# EAGLE design bmw (EAGLE 6.6.0)
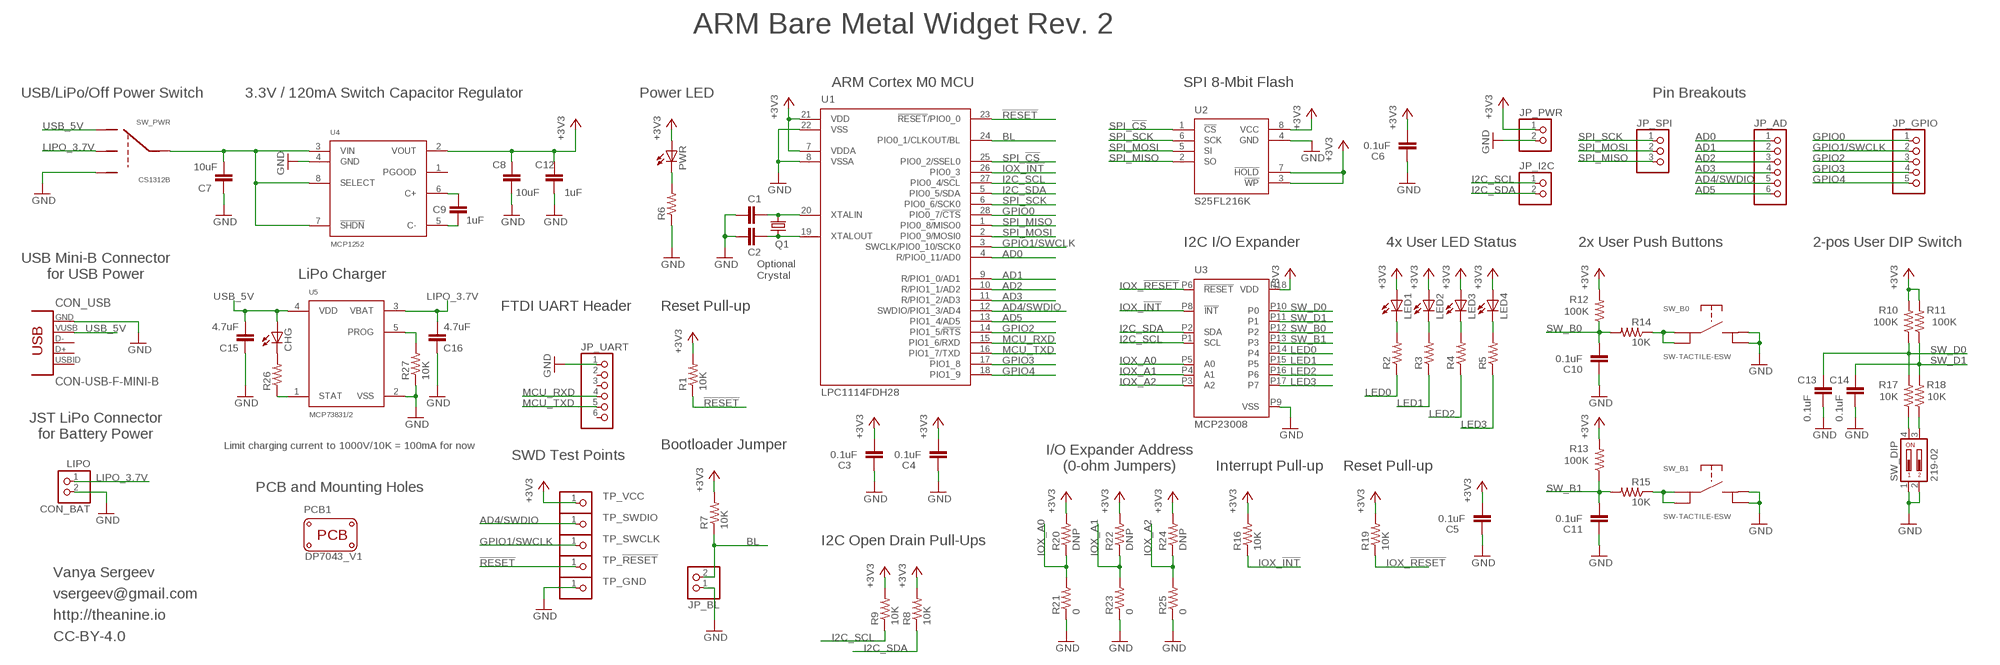
[diagram p0: schematic, sheet 1]

## Parts
C1  C-EUC0805  [C0805]
C2  C-EUC0805  [C0805]
C3  0.1uF  C-EUC0805  [C0805]
C4  0.1uF  C-EUC0805  [C0805]
C5  0.1uF  C-EUC0805  [C0805]
C6  0.1uF  C-EUC0805  [C0805]
C7  10uF  C-EUC1206  [C1206]
C8  10uF  C-EUC1206  [C1206]
C9  1uF  C-EUC0805  [C0805]
C10  0.1uF  C-EUC0805  [C0805]
C11  0.1uF  C-EUC0805  [C0805]
C12  1uF  C-EUC0805  [C0805]
C13  0.1uF  C-EUC0805  [C0805]
C14  0.1uF  C-EUC0805  [C0805]
C15  4.7uF  C-EUC0805  [C0805]
C16  4.7uF  C-EUC0805  [C0805]
CHG  LEDCHIPLED_0805  [CHIPLED_0805]
CON_BAT  LIPO  JST_2PIN-SMT-RA  [JST-PH-2-SMT-RA]
CON_USB  CON-USB-F-MINI-B  [CONN_USB_MINI-B]
JP_AD  PINHD-1X6  [1X06]
JP_BL  PINHD-1X2  [1X02]
JP_GPIO  PINHD-1X5  [1X05]
JP_I2C  PINHD-1X2  [1X02]
JP_PWR  PINHD-1X2  [1X02]
JP_SPI  PINHD-1X3  [1X03]
JP_UART  PINHD-1X6/90  [1X06/90]
LED1  LEDCHIPLED_0805  [CHIPLED_0805]
LED2  LEDCHIPLED_0805  [CHIPLED_0805]
LED3  LEDCHIPLED_0805  [CHIPLED_0805]
LED4  LEDCHIPLED_0805  [CHIPLED_0805]
PCB1  PCB_DP_RECTANGLE-43X70  [DP7043_V1]
PWR  LEDCHIPLED_0805  [CHIPLED_0805]
Q1  CRYSTALHC49UP  [HC49UP]
R1  10K  R-US_R0805  [R0805]
R2  R-US_R0805  [R0805]
R3  R-US_R0805  [R0805]
R4  R-US_R0805  [R0805]
R5  R-US_R0805  [R0805]
R6  R-US_R0805  [R0805]
R7  10K  R-US_R0805  [R0805]
R8  10K  R-US_R0805  [R0805]
R9  10K  R-US_R0805  [R0805]
R10  100K  R-US_R0805  [R0805]
R11  100K  R-US_R0805  [R0805]
R12  100K  R-US_R0805  [R0805]
R13  100K  R-US_R0805  [R0805]
R14  10K  R-US_R0805  [R0805]
R15  10K  R-US_R0805  [R0805]
R16  10K  R-US_R0805  [R0805]
R17  10K  R-US_R0805  [R0805]
R18  10K  R-US_R0805  [R0805]
R19  10K  R-US_R0805  [R0805]
R20  DNP  R-US_R0603  [R0603]
R21  0  R-US_R0603  [R0603]
R22  DNP  R-US_R0603  [R0603]
R23  0  R-US_R0603  [R0603]
R24  DNP  R-US_R0603  [R0603]
R25  0  R-US_R0603  [R0603]
R26  R-US_R0805  [R0805]
R27  10K  R-US_R0805  [R0805]
SW_B0  SW-TACTILE-ESW  [SW-TACT-ESW]
SW_B1  SW-TACTILE-ESW  [SW-TACT-ESW]
SW_DIP  219-02  [CTS-219-02]
SW_PWR  CS1312B  [CS1312B]
TP_!RESET  PINHD-1X1  [1X01]
TP_GND  PINHD-1X1  [1X01]
TP_SWCLK  PINHD-1X1  [1X01]
TP_SWDIO  PINHD-1X1  [1X01]
TP_VCC  PINHD-1X1  [1X01]
U1  LPC1114FDH28  [TSSOP28]
U2  S25FL216K  S25FL208K  [SOIC127P600X175-8N]
U3  MCP23008  [SOIC-18W]
U4  MCP1252  [MSOP8]
U5  MCP73831/2  [SOT23-5L]

## Nets
!RESET!: R1.1 TP_!RESET.1 U1.23(!RESET!/PIO0_0)
+3V3: C3.2 C4.2 C5.2 C6.2 C8.2 C12.2 JP_PWR.1 LED1.A LED2.A LED3.A LED4.A PWR.A R1.2 R7.2 R8.2 R9.2 R10.2 R11.2 R12.2 R13.2 R16.2 R19.2 R20.2 R22.2 R24.2 TP_VCC.1 U1.7(VDDA) U1.21(VDD) U2.3(!WP!) U2.7(!HOLD!) U2.8(VCC) U3.P18(VDD) U4.2(VOUT)
AD0: JP_AD.1 U1.4(R/PIO0_11/AD0)
AD1: JP_AD.2 U1.9(R/PIO1_0/AD1)
AD2: JP_AD.3 U1.10(R/PIO1_1/AD2)
AD3: JP_AD.4 U1.11(R/PIO1_2/AD3)
AD4/SWDIO: JP_AD.5 TP_SWDIO.1 U1.12(SWDIO/PIO1_3/AD4)
AD5: JP_AD.6 U1.13(PIO1_4/AD5)
BL: JP_BL.2 R7.1 U1.24(PIO0_1/CLKOUT/BL)
GND: C1.1 C2.1 C3.1 C4.1 C5.1 C6.1 C7.1 C8.1 C10.1 C11.1 C12.1 C13.2 C14.2 C15.1 C16.1 CON_BAT.2 CON_USB.GND JP_BL.1 JP_PWR.2 JP_UART.1 R6.1 R21.1 R23.1 R25.1 R27.1 SW_B0.P3 SW_B0.P4 SW_B1.P3 SW_B1.P4 SW_DIP.1 SW_DIP.2 SW_PWR.P4 TP_GND.1 U1.8(VSSA) U1.22(VSS) U2.4(GND) U3.P9(VSS) U4.4(GND) U5.2(VSS)
GPIO0: JP_GPIO.1 U1.28(PIO0_7/!CTS!)
GPIO1/SWCLK: JP_GPIO.2 TP_SWCLK.1 U1.3(SWCLK/PIO0_10/SCK0)
GPIO2: JP_GPIO.3 U1.14(PIO1_5/!RTS!)
GPIO3: JP_GPIO.4 U1.17(PIO1_8)
GPIO4: JP_GPIO.5 U1.18(PIO1_9)
I2C_SCL: JP_I2C.1 R9.1 U1.27(PIO0_4/SCL) U3.P1(SCL)
I2C_SDA: JP_I2C.2 R8.1 U1.5(PIO0_5/SDA) U3.P2(SDA)
IOX_!INT: R16.1 U1.26(PIO0_3) U3.P8(!INT)
IOX_!RESET: R19.1 U3.P6(!RESET)
IOX_A0: R20.1 R21.2 U3.P5(A0)
IOX_A1: R22.1 R23.2 U3.P4(A1)
IOX_A2: R24.1 R25.2 U3.P3(A2)
LED0: R2.1 U3.P14(P4)
LED1: R3.1 U3.P15(P5)
LED2: R4.1 U3.P16(P6)
LED3: R5.1 U3.P17(P7)
LIPO_3.7V: C16.2 CON_BAT.1 SW_PWR.P2 U5.3(VBAT)
MCU_RXD: JP_UART.4 U1.15(PIO1_6/RXD)
MCU_TXD: JP_UART.5 U1.16(PIO1_7/TXD)
N$1: R17.1 SW_DIP.4
N$2: C1.2 Q1.2 U1.20(XTALIN)
N$3: C2.2 Q1.1 U1.19(XTALOUT)
N$4: PWR.C R6.2
N$5: C7.2 SW_PWR.P3(C) U4.3(VIN) U4.7(!SHDN) U4.8(SELECT)
N$6: C9.2 U4.6(C+)
N$7: C9.1 U4.5(C-)
N$8: LED1.C R2.2
N$9: LED2.C R3.2
N$10: LED3.C R4.2
N$11: LED4.C R5.2
N$12: R14.1 SW_B0.P1 SW_B0.P2
N$13: R15.1 SW_B1.P1 SW_B1.P2
N$14: R18.1 SW_DIP.3
N$15: CHG.C R26.2
N$16: R26.1 U5.1(STAT)
N$17: R27.2 U5.5(PROG)
SPI_!CS!: U1.25(PIO0_2/SSEL0) U2.1(!CS!)
SPI_MISO: JP_SPI.3 U1.1(PIO0_8/MISO0) U2.2(SO)
SPI_MOSI: JP_SPI.2 U1.2(PIO0_9/MOSI0) U2.5(SI)
SPI_SCK: JP_SPI.1 U1.6(PIO0_6/SCK0) U2.6(SCK)
SW_B0: C10.2 R12.1 R14.2 U3.P12(P2)
SW_B1: C11.2 R13.1 R15.2 U3.P13(P3)
SW_D0: C13.1 R10.1 R17.2 U3.P10(P0)
SW_D1: C14.1 R11.1 R18.2 U3.P11(P1)
USB_5V: C15.2 CHG.A CON_USB.VUSB SW_PWR.P1 U5.4(VDD)
Unconnected: CON_USB.BODY@1(BODY) CON_USB.BODY@2(BODY) CON_USB.BODY@3(BODY) CON_USB.BODY@4(BODY) CON_USB.D+ CON_USB.D- CON_USB.ID(USBID) JP_UART.2 JP_UART.3 JP_UART.6 U4.1(PGOOD)

## Notes on the sheet
- ARM Bare Metal Widget Rev. 2
- ARM Cortex M0 MCU | SPI 8-Mbit Flash
- USB/LiPo/Off Power Switch | 3.3V / 120mA Switch Capacitor Regulator | Power LED | Pin Breakouts
- I2C I/O Expander | 4x User LED Status | 2x User Push Buttons | 2-pos User DIP Switch
- USB Mini-B Connector
  for USB Power
- LiPo Charger
- Optional
  Crystal
- FTDI UART Header | Reset Pull-up
- JST LiPo Connector
  for Battery Power
- Limit charging current to 1000V/10K = 100mA for now | Bootloader Jumper
- SWD Test Points
- I/O Expander Address
  (0-ohm Jumpers)
- Interrupt Pull-up | Reset Pull-up
- PCB and Mounting Holes
- I2C Open Drain Pull-Ups
- Vanya Sergeev
- vsergeev@gmail.com
- http://theanine.io
- CC-BY-4.0

## Library data of the parts
C1-C16 = rcl:C-EU: CAPACITOR, European symbol
CHG LED1-LED4 PWR = led:LED: LED OSRAM: - CHIPLED LG R971, LG N971, LY N971, LG Q971, LY Q971, LO R971, LY R971 LH N974, LH R974 LS Q976, LO Q976, LY Q976 LO Q996 - Hyper CHIPLED LW Q18S LB Q993, LB Q99A, LB R99A - SideLED LS A670, LO A670, LY A670, LG A670, LP A670 LB A673, LV A673, LT A673, LW A673 LH A674 LY A675 LS A676, LA A676, LO A676, LY A676, LW A676 LS A679, LY A679, LG A679 - Hyper Micro SIDELED® LS Y876, LA Y876, LO Y876, LY Y876 LT Y87S - SmartLED LW L88C, LW L88S LB L89C, LB L89S, LG L890 LS L89K, LO L89K, LY L89K LS L896, LA L896, LO L896, LY L896 - TOPLED LS T670, LO T670, LY T670, LG T670, LP T670 LSG T670, LSP T670, LSY T670, LOP T670, LYG T670 LG T671, LOG T671, LSG T671 LB T673, LV T673, LT T673, LW T673 LH T674 LS T676, LA T676, LO T676, LY T676, LB T676, LH T676, LSB T676, LW T676 LB T67C, LV T67C, LT T67C, LS T67K, LO T67K, LY T67K, LW E67C LS E67B, LA E67B, LO E67B, LY E67B, LB E67C, LV E67C, LT E67C LW T67C LS T679, LY T679, LG T679 LS T770, LO T770, LY T770, LG T770, LP T770 LB T773, LV T773, LT T773, LW T773 LH T774 LS E675, LA E675, LY E675, LS T675 LS T776, LA T776, LO T776, LY T776, LB T776 LHGB T686 LT T68C, LB T68C - Hyper Mini TOPLED® LB M676 - Mini TOPLED Santana® LG M470 LS M47K, LO M47K, LY M47K Source: http://www.osram.convergy.de LUXEON: - LUMILED® LXK2-PW12-R00, LXK2-PW12-S00, LXK2-PW14-U00, LXK2-PW14-V00 LXK2-PM12-R00, LXK2-PM12-S00, LXK2-PM14-U00 LXK2-PE12-Q00, LXK2-PE12-R00, LXK2-PE12-S00, LXK2-PE14-T00, LXK2-PE14-U00 LXK2-PB12-K00, LXK2-PB12-L00, LXK2-PB12-M00, LXK2-PB14-N00, LXK2-PB14-P00, LXK2-PB14-Q00 LXK2-PR12-L00, LXK2-PR12-M00, LXK2-PR14-Q00, LXK2-PR14-R00 LXK2-PD12-Q00, LXK2-PD12-R00, LXK2-PD12-S00 LXK2-PH12-R00, LXK2-PH12-S00 LXK2-PL12-P00, LXK2-PL12-Q00, LXK2-PL12-R00 Source: www.luxeon.com KINGBRIGHT: KA-3528ASYC Source: www.kingbright.com
CON_BAT = adafruit:JST_2PIN: JST 2-Pin Connectors of various flavors SMT-RA (S2B-PH-SM4) 4UConnector #17311 SMT (B2B-PH-SM4) THM-RA (S2B-PH) THM (B2B-PH)
CON_USB = dp_devices:CON-USB-F: USB Female connector
JP_AD JP_UART = pinhead:PINHD-1X6: PIN HEADER
JP_BL JP_I2C JP_PWR = pinhead:PINHD-1X2: PIN HEADER
JP_GPIO = pinhead:PINHD-1X5: PIN HEADER
JP_SPI = pinhead:PINHD-1X3: PIN HEADER
PCB1 = dp_devices:PCB_DP_RECTANGLE: Dangerous Prototypes Standard Rectangular PCB sizes; PCB_SIZE: DP7043_V1
Q1 = crystal:CRYSTAL: CRYSTAL; OC_FARNELL: unknown; OC_NEWARK: unknown
R1-R27 = rcl:R-US_: RESISTOR, American symbol
SW_B0 SW_B1 = ivan:SW-TACTILE-ESW
SW_DIP = switch-dil:219-02*: Surface Mount DIP Switch Series 219 SMT CTS Electronic Components Sourc: www.ctscorp.com; OC_FARNELL: unknown; OC_NEWARK: unknown
SW_PWR = ivan:CS1312B
TP_!RESET TP_GND TP_SWCLK TP_SWDIO TP_VCC = pinhead:PINHD-1X1: PIN HEADER
U1 = ivan:LPC1114FDH28
U2 = ivan:S25FL208K
U3 = ivan:MCP23008
U4 = ivan:MCP1252
U5 = ivan:MCP73831/2

## Board
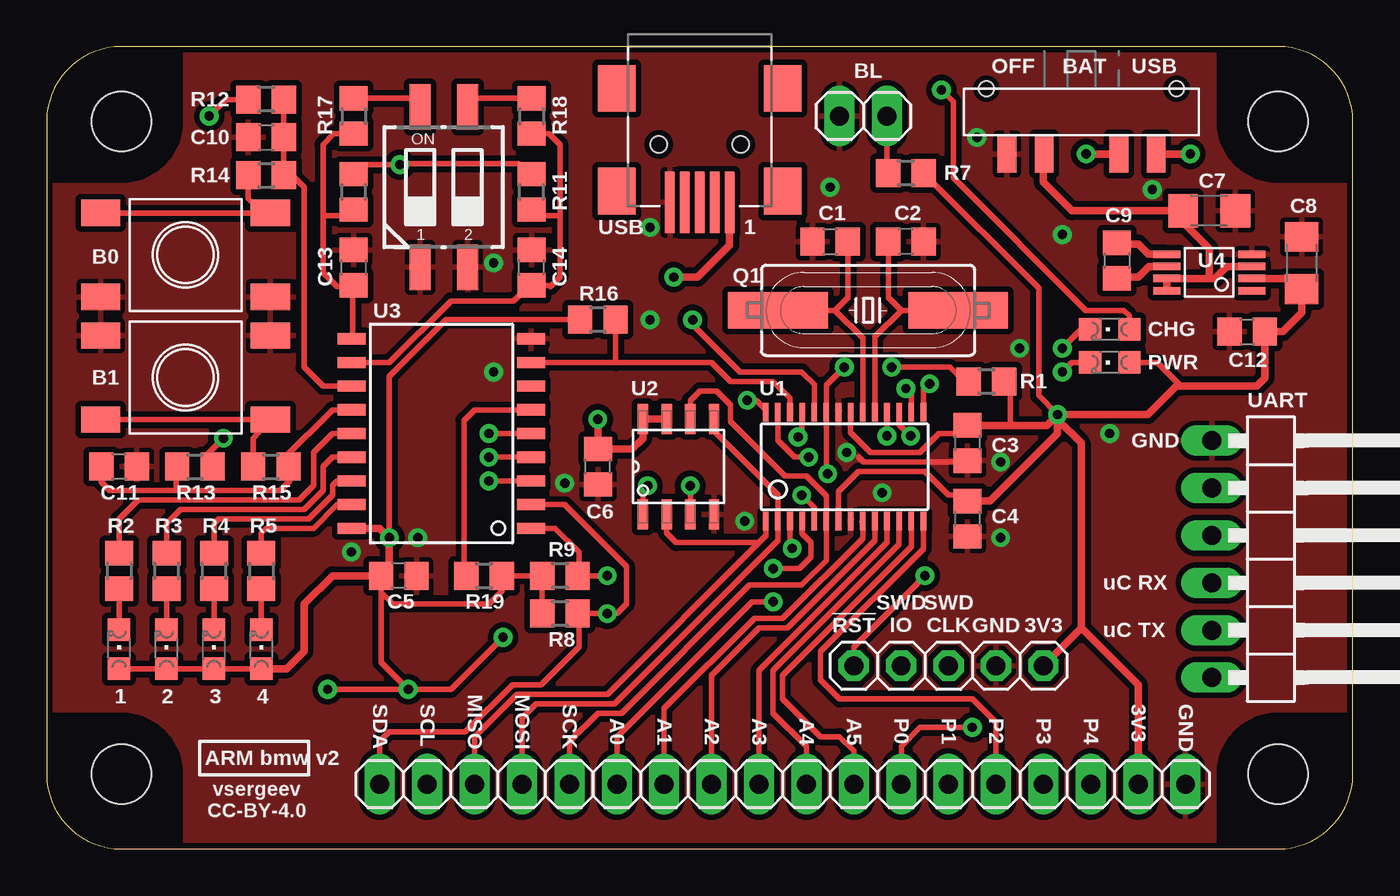
[diagram p1: board, top side]
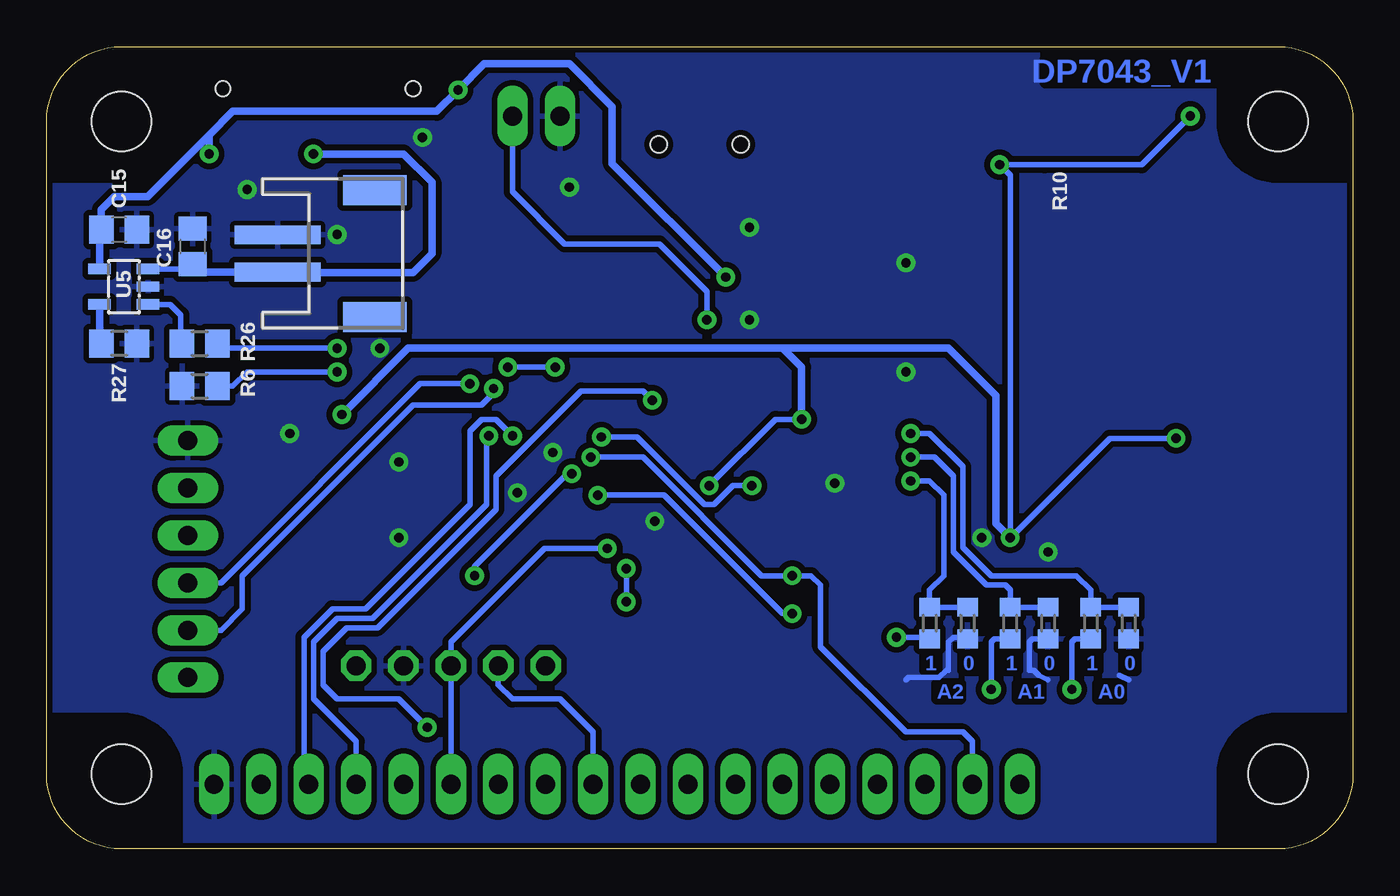
[diagram p2: board, bottom side, seen from below]

Size 70 x 43 mm. Coordinates in mm from the lower left corner, seen from the top.
Copper layers (1*16): Top 0.035mm / dielectric 1.5mm / Bottom 0.035mm
Design rules "SparkFun-mod": minimum track width 8mil, minimum drill 15mil, track to track 6mil, track to pad 6mil, pad to pad 6mil, via to via 6mil, smd to smd 6mil, copper to edge 10mil, drill to drill 8mil, minimum pad ring 12mil, minimum via ring 10mil, stop-mask expansion 4mil, vias tented up to drill 25mil, thermal gap 10mil

### Footprints (pad centres in the part's own frame; a part is rotated, then mirrored left to right if it is on the bottom)
C0805 = smd 1.3 x 1.5: 1 -0.95,0; 2 0.95,0
C1206 = smd 1.6 x 1.8: 1 -1.4,0; 2 1.4,0
CHIPLED_0805 = smd 1.2 x 1.2: A 0,-1.05; C 0,1.05
JST-PH-2-SMT-RA = smd 1 x 4.6: 1 1,-3.7; 2 -1,-3.7 | smd 1.6 x 3.4: NC1 -3.4,1.5; NC2 3.4,1.5
CONN_USB_MINI-B = smd 2 x 2.5: BODY@1 -4.45,2.5; BODY@2 4.45,2.5; BODY@3 4.45,-3; BODY@4 -4.45,-3 | smd 0.5 x 3.3: D+ 0,3.1; D- -0.8,3.1; GND 1.6,3.1; ID 0.8,3.1; VUSB -1.6,3.1 | hole 0.9: -2.2,0; 2.2,0
1X06 = drill 1.016 long: 1 -6.35,0; 2 -3.81,0; 3 -1.27,0; 4 1.27,0; 5 3.81,0; 6 6.35,0
1X02 = drill 1.016 long: 1 -1.27,0; 2 1.27,0
1X05 = drill 1.016 long: 1 -5.08,0; 2 -2.54,0; 3 0,0; 4 2.54,0; 5 5.08,0
1X03 = drill 1.016 long: 1 -2.54,0; 2 0,0; 3 2.54,0
1X06/90 = drill 1.016 long: 1 -6.35,-3.81; 2 -3.81,-3.81; 3 -1.27,-3.81; 4 1.27,-3.81; 5 3.81,-3.81; 6 6.35,-3.81
DP7043_V1 = hole 3.2: -31,-17.5; 31,-17.5; 31,17.5; -31,17.5
HC49UP = smd 5.334 x 1.93: 1 -4.826,0; 2 4.826,0
R0805 = smd 1.3 x 1.5: 1 -0.95,0; 2 0.95,0
R0603 = smd 1 x 1.1: 1 -0.85,0; 2 0.85,0
SW-TACT-ESW = smd 2.1 x 1.4: P1 -4.55,2.3; P2 4.55,2.3; P3 -4.55,-2.2; P4 4.55,-2.2
CTS-219-02 = smd 1.13 x 2.44: 1 -1.27,-4.3; 2 1.27,-4.3; 3 1.27,4.3; 4 -1.27,4.3
CS1312B = smd 1 x 2: P1 -0.2,0; P2 1.8,0; P3 5.8,0; P4 7.8,0 | hole 0.8: 8.9,-3.5; -1.3,-3.5
1X01 = drill 1.016 octagon: 1 0,0
TSSOP28 = smd 0.305 x 0.991: 1 -4.225,-2.918; 2 -3.575,-2.918; 3 -2.925,-2.918; 4 -2.275,-2.918; 5 -1.625,-2.918; 6 -0.975,-2.918; 7 -0.325,-2.918; 8 0.325,-2.918; 9 0.975,-2.918; 10 1.625,-2.918; 11 2.275,-2.918; 12 2.925,-2.918; 13 3.575,-2.918; 14 4.225,-2.918; 15 4.225,2.918; 16 3.575,2.918; 17 2.925,2.918; 18 2.275,2.918; 19 1.625,2.918; 20 0.975,2.918; 21 0.325,2.918; 22 -0.325,2.918; 23 -0.975,2.918; 24 -1.625,2.918; 25 -2.275,2.918; 26 -2.925,2.918; 27 -3.575,2.918; 28 -4.225,2.918
SOIC127P600X175-8N = smd 1.6 x 0.559: 1 -2.565,1.905; 2 -2.565,0.635; 3 -2.565,-0.635; 4 -2.565,-1.905; 5 2.565,-1.905; 6 2.565,-0.635; 7 2.565,0.635; 8 2.565,1.905
SOIC-18W = smd 0.6 x 1.5: P1 -5.08,-4.81; P2 -3.81,-4.81; P3 -2.54,-4.81; P4 -1.27,-4.81; P5 0,-4.81; P6 1.27,-4.81; P7 2.54,-4.81; P8 3.81,-4.81; P9 5.08,-4.81; P10 5.08,4.81; P11 3.81,4.81; P12 2.54,4.81; P13 1.27,4.81; P14 0,4.81; P15 -1.27,4.81; P16 -2.54,4.81; P17 -3.81,4.81; P18 -5.08,4.81
MSOP8 = smd 0.4 x 1.45: 1 -0.975,-2.275; 2 -0.325,-2.275; 3 0.325,-2.275; 4 0.975,-2.275; 5 0.975,2.275; 6 0.325,2.275; 7 -0.325,2.275; 8 -0.975,2.275
SOT23-5L = smd 0.55 x 1.2: 1 -0.95,-1.3; 2 0,-1.3; 3 0.95,-1.3; 4 0.95,1.3; 5 -0.95,1.3

### Placement (x,y rotation side)
C1  41.98,32.55 0 top
C2  46.05,32.55 180 top
C3  49.35,21.75 90 top
C4  49.35,17.69 90 top
C5  18.87,14.64 180 top
C6  29.54,20.48 90 top
C7  62.3,34.2 180 top
C8  67.26,31.41 270 top
C9  57.35,31.53 270 top
C10  11.76,38.14 0 top
C11  3.88,20.48 180 top
C12  64.34,27.72 0 top
C13  16.46,31.15 90 top
C14  25.98,31.15 90 top
C15  66.11,33.18 180 bottom
C16  62.18,32.3 270 bottom
CHG  56.97,27.85 90 top
CON_BAT  53.92,31.91 270 bottom
CON_USB  35,37.76 180 top
JP_AD  36.91,3.47 0 top
JP_BL  43.76,39.28 0 top
JP_GPIO  50.88,3.47 0 top
JP_I2C  19.12,3.47 180 top
JP_PWR  59.77,3.47 0 top
JP_SPI  25.48,3.47 180 top
JP_UART  66.24,15.53 270 top
LED1  3.88,10.7 0 top
LED2  6.42,10.7 0 top
LED3  8.96,10.7 0 top
LED4  11.5,10.7 0 top
PCB1  35,21.5 0 top
PWR  56.97,26.07 90 top
Q1  44.02,28.87 180 top
R1  50.37,25.06 0 top
R2  3.88,14.9 270 top
R3  6.42,14.9 270 top
R4  8.96,14.9 270 top
R5  11.5,14.9 270 top
R6  61.8,24.8 0 bottom
R7  46.05,36.23 0 top
R8  27.51,12.61 180 top
R9  27.51,14.64 180 top
R10  16.46,35.22 90 top
R11  25.98,35.22 90 top
R12  11.76,40.17 180 top
R13  7.95,20.48 0 top
R14  11.76,36.1 0 top
R15  12.01,20.48 0 top
R16  29.54,28.36 180 top
R17  16.46,39.28 270 top
R18  25.98,39.28 270 top
R19  23.44,14.64 0 top
R20  14.05,12.1 270 bottom
R21  12.01,12.1 90 bottom
R22  18.36,12.1 270 bottom
R23  16.33,12.1 90 bottom
R24  22.68,12.1 270 bottom
R25  20.65,12.1 90 bottom
R26  61.8,27.09 0 bottom
R27  66.11,27.09 180 bottom
SW_B0  7.44,31.79 0 top
SW_B1  7.44,25.31 180 top
SW_DIP  21.28,35.47 0 top
SW_PWR  59.26,37.25 180 top
TP_!RESET  43.25,9.82 0 top
TP_GND  50.88,9.82 0 top
TP_SWCLK  48.33,9.82 0 top
TP_SWDIO  45.8,9.82 0 top
TP_VCC  53.41,9.82 0 top
U1  42.76,20.48 0 top
U2  33.86,20.48 90 top
U3  21.16,22.26 90 top
U4  62.3,30.9 90 top
U5  65.86,30.14 90 bottom

### Tracks (layer width: path | path; a pad name or v marks a point on that pad's centre or on a via)
!RESET!  (via drill 0.5)
  Top 0.305: v41.86,20.1 41.78,20.18 U1.23 41.78,24.86 v42.75,25.82 | v47.06,14.64 43.25,10.83 TP_!RESET.1 | v45.29,25.82 48.4,25.82 49.16,25.06 R1.1
  Bottom 0.305: v42.75,25.82 v45.29,25.82 | v41.86,20.1 42.11,20.1 47.06,15.15 v47.06,14.64
+3V3  (via drill 0.5)
  Top 0.305: LED1.A LED2.A LED3.A LED4.A | U1.7 42.43,19.15 43.51,20.23 47.06,20.23 48.33,18.96 48.78,18.96 C4.2 | R13.2 8.52,21.05 v9.47,22.01 | U2.3 v34.49,19.47 | 50.81,25.06 R1.2 51.64,25.06 51.64,22.7 | U1.21 43.08,22.3 44.14,21.25 46.81,21.25 47.83,22.26 48.91,22.26 C3.2 | 54.18,23.02 v54.18,23.28 53.16,24.29 53.16,30.07 R7.2 | 49.1,18.89 C4.2 | 49.03,18.45 C4.2 | R10.2 16.97,36.67 v18.92,36.67 18.99,36.74 25.28,36.74 R11.2 | R12.2 9.6,40.17 v8.71,39.28 | v18.36,16.67 18.36,25.31 21.41,28.36 R16.2 28.34,28.61 | v19.38,8.55 21.66,8.55 v24.46,11.34 | R8.2 R9.2 R19.2 24.39,13.81 23.7,13.12 18.56,13.12 17.92,13.75 | v19.38,8.55 17.92,10 17.92,13.75 | 17.92,13.75 C5.2 | v15.06,8.55 v19.38,8.55 | 60.78,24.8 59.51,26.07 PWR.A
  Top 0.406: U4.2 66.94,30.57 67.26,30.26 C8.2 67.26,28.74 66.24,27.72 C12.2 65.29,25.24 64.84,24.8 60.78,24.8 60.53,24.8 59,23.28 v54.18,23.28 | LED4.A 12.87,9.65 13.79,10.58 13.79,13.12 15.31,14.64 C5.2 | U2.7 U2.8 31.95,22.01 31.38,21.43 C6.2 v29.54,23.02 | 54.18,23.02 55.45,21.75 55.45,11.85 | 55.45,11.85 TP_VCC.1 | C3.2 51.64,22.7 53.6,22.7 v54.18,23.28 | C4.2 50.55,18.64 54.18,22.26 v54.18,23.28 | C5.2 18.36,14.77 | U3.P18 17.85,17.18 v18.36,16.67 18.36,14.64 C5.2 | 26.62,14.45 R9.2 | 55.45,11.85 58.5,8.8 JP_PWR.1
  Bottom 0.305: 16.52,36.67 v18.92,36.67 | v34.49,19.47 30.94,23.02 v29.54,23.02 | v8.71,39.28 11.32,36.67 v18.92,36.67 | v9.47,22.01 13.03,22.01 v18.36,16.67 18.36,36.11 v18.92,36.67 | R24.2 22.77,11.34 v24.46,11.34 | R20.2 14.89,11.25 15.06,11.09 v15.06,8.55 | R22.2 19.21,11.25 19.38,11.09 v19.38,8.55
  Bottom 0.406: v29.54,23.02 29.54,25.82 30.55,26.83 | v54.18,23.28 50.62,26.83 30.55,26.83 | 30.55,26.83 21.66,26.83 19.12,24.29 19.12,17.44 v18.36,16.67
AD0  (via drill 0.5)
  Top 0.305: JP_AD.1 30.55,6.01 37.79,13.24 v38.94,13.24 | U1.4 40.48,16.9 40.97,16.42 40.97,15.66 40.33,15.02 v38.94,15.02
  Bottom 0.305: v38.94,13.24 v38.94,15.02
AD1
  Top 0.305: 43.7,17.53 U1.9 43.73,16.65 39.44,12.36 37.92,12.36 33.09,7.53 JP_AD.2
AD2
  Top 0.305: 44.4,17.55 U1.10 44.39,16.53 39.7,11.85 38.17,11.85 35.64,9.31 JP_AD.3
AD3
  Top 0.305: 45.03,16.67 U1.11 45.03,16.42 38.17,9.56 JP_AD.4
AD4/SWDIO
  Top 0.305: 45.67,17.55 U1.12 45.69,16.67 45.69,16.56 45.69,16.31 38.94,9.56 38.94,7.28 40.72,5.5 JP_AD.5
  Bottom 0.305: JP_AD.5 40.72,6.26 42.49,8.04 45.03,8.04 45.8,8.8 TP_SWDIO.1
AD5
  Top 0.305: JP_AD.6 43.25,5.24 42.49,6.01 41.48,6.01 39.44,8.04 39.44,9.31 46.33,16.2 U1.13
BL  (via drill 0.5)
  Top 0.305: JP_BL.2 45.03,36.3 R7.1 | U1.24 41.14,24.89 40.46,25.56 37.16,25.56 34.62,28.1 v34.62,28.36
  Bottom 0.305: JP_BL.2 45.03,35.22 42.24,32.42 37.16,32.42 34.62,29.88 v34.62,28.36
GND  (via drill 0.5)
  Top 0.305: 49.1,20.74 43.76,20.74 43.51,20.99
  Bottom 0.305: 20.65,11.34 21.41,11.34 21.66,11.09 21.66,9.56 21.79,9.56 22.17,9.18 23.82,9.18 23.95,9.05 | 16.33,9.05 16.84,9.31 17.09,9.56 17.35,9.56 17.35,11.09 17.18,11.25 R23.1 | 12.52,9.31 12.01,9.05
  Bottom 0.406: R25.1 20.65,11.34
  other vias: 23.95,31.41 56.97,22.26 19.89,16.67 44.78,19.09 51.13,20.74 42.87,21.25 37.41,17.56 27.76,19.59 51.13,16.67 16.33,15.91 23.95,25.56 32.33,28.36 41.98,35.47 49.86,38.14 59.26,35.34 32.33,33.31 52.14,26.83 54.43,32.93
  pour Top (isolate 0.305): 0.07,42.84 69.92,43.09 69.92,0.16 0.07,0.16
  pour Bottom (isolate 0.305): 0.07,43.09 69.92,43.09 69.92,0.16 0.07,0.16
GPIO0  (via drill 0.5)
  Top 0.305: JP_GPIO.1 45.8,5.5 46.81,6.51 v49.61,6.51 | U1.28 38.53,23.55 38.05,24.04 v37.54,24.04
  Bottom 0.305: v37.54,24.04 38.05,24.55 41.35,24.55 45.92,19.98 45.92,18.2 52.27,11.85 53.92,11.85 55.19,10.58 55.19,8.8 54.43,8.04 51.13,8.04 v49.61,6.51
GPIO1/SWCLK  (via drill 0.5)
  Top 0.305: U1.3 39.83,16.22 v39.95,16.1
  Bottom 0.305: JP_GPIO.2 TP_SWCLK.1 48.33,11.09 43.32,16.1 v39.95,16.1
GPIO2
  Top 0.305: JP_GPIO.3 50.88,6.77 49.61,8.04 42.49,8.04 41.48,9.05 41.48,10.58 46.98,16.09 U1.14
GPIO3  (via drill 0.5)
  Top 0.305: U1.17 45.69,22.75 v46.3,22.13
  Bottom 0.305: v46.3,22.13 46.43,22.13 46.43,18.45 52.53,12.36 54.43,12.36 55.7,11.09 55.7,8.04 53.41,5.75 JP_GPIO.4
GPIO4  (via drill 0.5)
  Top 0.305: U1.18 v45.03,22.14 v45.03,22.13
  Bottom 0.305: v45.03,22.13 45.92,23.02 46.68,23.02 47.32,22.39 47.32,18.45 52.91,12.86 54.69,12.86 56.21,11.34 56.21,3.72 JP_GPIO.5
I2C_SCL  (via drill 0.5)
  Top 0.305: 28.52,14.58 R9.1 | U1.27 39.19,21.89 40.08,20.99 v40.84,20.99 | U3.P1 27.25,17.18 28.52,15.91 28.52,14.71 R9.1 | R9.1 28.71,14.39 28.96,14.64 v30.05,14.64
  Bottom 0.305: v40.84,20.99 38.05,20.99 31.7,14.64 v30.05,14.64 | 29.28,14.64 v30.05,14.64 | JP_I2C.1 20.39,5.75 20.9,6.26 23.95,6.26 28.52,10.83 28.52,14.13 29.03,14.64 v30.05,14.64
I2C_SDA  (via drill 0.5)
  Top 0.305: U1.5 41.14,18.29 v40.46,18.96 | U3.P2 27.76,18.45 31.06,15.15 31.06,13.12 30.55,12.61 v30.05,12.61 28.96,12.61 28.71,12.36 R8.1 28.52,12.29 28.52,10.83 26.49,8.8 24.97,8.8 22.43,6.26 18.36,6.26 17.85,5.75 JP_I2C.2
  Bottom 0.305: v40.46,18.96 36.91,18.96 30.55,12.61 v30.05,12.61
IOX_!INT
  Top 0.305: U1.26 39.83,24.16 38.94,25.06 36.65,25.06 35.64,26.07 30.55,26.07 30.49,26.07 | 30.49,26.07 U3.P8 | R16.1 30.49,26.07
IOX_!RESET
  Top 0.305: U3.P6 22.94,23.53 22.37,22.96 22.37,14.77 R19.1
IOX_A0  (via drill 0.5)
  Top 0.305: U3.P5 v23.7,22.26
  Bottom 0.305: R21.2 R20.1 14.05,13.88 14.81,14.64 19.38,14.64 20.9,16.17 20.9,20.48 22.68,22.26 v23.7,22.26
IOX_A1  (via drill 0.5)
  Top 0.305: U3.P4 v23.7,20.99
  Bottom 0.305: 18.07,12.82 R22.1 | R23.2 R22.1 | v23.7,20.99 22.43,20.99 21.41,19.98 21.41,15.91 19.63,14.13 18.62,14.13 18.36,13.88 R22.1
IOX_A2  (via drill 0.5)
  Top 0.305: U3.P3 v23.7,19.72
  Bottom 0.305: R25.2 R24.1 22.68,13.88 21.92,14.64 21.92,18.96 22.68,19.72 v23.7,19.72
LED0
  Top 0.305: R2.1 3.88,17.69 4.9,18.71 13.54,18.71 14.3,19.47 14.3,21.25 15.31,22.26 U3.P14
LED1
  Top 0.305: R3.1 6.42,17.44 7.19,18.2 13.79,18.2 14.81,19.21 14.81,20.48 15.31,20.99 U3.P15
LED2
  Top 0.305: U3.P16 15.57,19.72 15.31,19.47 15.31,18.96 14.05,17.69 9.22,17.69 8.96,17.44 R4.1
LED3
  Top 0.305: U3.P17 15.57,18.45 14.3,17.18 11.76,17.18 11.5,16.93 R5.1
LIPO_3.7V  (via drill 0.5)
  Top 0.406: SW_PWR.P2 v55.7,37.25
  Bottom 0.305: U5.3 62.69,31.09 62.56,30.96
  Bottom 0.406: C16.2 62.56,30.96 | 62.05,31.22 C16.2 | v55.7,37.25 50.88,37.25 49.35,35.72 49.35,31.91 50.37,30.9 57.61,30.9 CON_BAT.1 61.75,30.91 C16.2
MCU_RXD  (via drill 0.5)
  Top 0.305: U1.15 46.98,24.59 v47.32,24.93
  Bottom 0.305: JP_UART.4 60.65,14.26 49.99,24.93 v47.32,24.93
MCU_TXD  (via drill 0.5)
  Top 0.305: U1.16 46.33,24.39 v46.05,24.67
  Bottom 0.305: 61.03,11.72 JP_UART.5 60.65,11.72 59.51,12.86 59.51,14.64 50.37,23.79 46.68,23.79 46.05,24.42 v46.05,24.67
N$1
  Top 0.305: R17.1 19.43,40.23 SW_DIP.4
N$2
  Top 0.305: 39.89,28.23 39.83,28.23 Q1.2 | Q1.2 40.53,28.87 | U1.20 43.73,27.37 42.24,28.87 | 42.24,28.87 Q1.2 | C1.2 42.94,29.56 42.24,28.87
N$3
  Top 0.305: 48.65,29.06 Q1.1 45.8,28.87 | U1.19 44.39,27.46 45.8,28.87 | C2.2 45.1,29.56 45.8,28.87
N$4  (via drill 0.5)
  Top 0.305: v54.43,25.56 54.94,26.07 PWR.C
  Bottom 0.305: v54.43,25.56 59.26,25.56 60.02,24.8 R6.2
N$5
  Top 0.406: U4.8 U4.7 62.3,30.57 | 62.3,30.57 62.61,30.57 63.26,31.22 U4.3 | 62.3,30.57 62.3,32.17 60.91,33.57 C7.2 54.94,34.2 53.41,35.72 53.41,37.21 SW_PWR.P3
N$6
  Top 0.406: U4.6 59.07,31.22 58.5,30.64 57.41,30.64 C9.2
N$7
  Top 0.406: U4.5 59.04,31.87 58.5,32.42 57.41,32.42 C9.1
N$8
  Top 0.305: R2.2 LED1.C
N$9
  Top 0.305: R3.2 LED2.C
N$10
  Top 0.305: R4.2 LED3.C
N$11
  Top 0.305: R5.2 LED4.C
N$12
  Top 0.305: 11.25,34.21 11.5,34.17 | 11.5,34.17 SW_B0.P2 SW_B0.P1 | R14.1 10.81,34.86 11.5,34.17
N$13
  Top 0.305: 2.68,23.07 SW_B1.P2 SW_B1.P1 11.06,21.99 R15.1
N$14
  Top 0.305: R18.1 22.89,40.23 SW_DIP.3
N$15  (via drill 0.5)
  Top 0.305: CHG.C 55.45,27.85 v54.43,26.83
  Bottom 0.305: v54.43,26.83 60.59,26.83 R26.2
N$16
  Bottom 0.305: U5.1 63.39,29.19 62.81,28.61 62.81,27.15 R26.1
N$17
  Bottom 0.406: U5.5 67.16,27.18 R27.2
SPI_!CS!  (via drill 0.5)
  Top 0.305: U2.1 31.95,19.21 v32.21,19.47 | U1.25 40.48,22.29 v40.27,22.07
  Bottom 0.305: v32.21,19.47 33.22,19.47 34.24,18.45 34.75,18.45 38.36,22.07 v40.27,22.07
SPI_MISO
  Top 0.305: U2.2 33.22,16.93 33.73,16.42 38.17,16.42 | U1.1 38.56,17.54 38.56,16.8 38.17,16.42 | JP_SPI.3 22.94,6.01 25.22,8.29 30.05,8.29 38.17,16.42
SPI_MOSI
  Top 0.305: U2.5 35.76,22.39 39.19,18.96 U1.2 | U1.2 | U1.2 39.19,16.54 30.43,7.78 26.24,7.78 25.48,7.02 JP_SPI.2
SPI_SCK
  Top 0.305: 34.49,23.53 U2.6 34.49,24.04 35,24.55 35.89,24.55 36.65,23.79 36.65,22.9 39.57,19.98 40.72,19.98 41.78,18.91 U1.6 | 41.8,17.56 U1.6 | JP_SPI.1 28.02,5.75 29.54,7.28 30.81,7.28 37.67,14.13 40.46,14.13 41.78,15.46 U1.6
SW_B0
  Top 0.305: R12.1 C10.2 R14.2 13.16,36.1 13.79,35.47 13.79,25.82 14.81,24.8 U3.P12
SW_B1
  Top 0.305: 6.93,19.21 3.38,19.21 2.94,19.66 C11.2 | 6.93,19.21 12.52,19.21 13.03,19.72 13.03,20.42 R15.2 | 12.52,20.54 R15.2 | R15.2 12.45,20.93 12.71,20.93 15.31,23.53 U3.P13 | R13.1 6.93,20.42 6.93,19.21
SW_D0
  Top 0.305: R17.2 15.38,38.33 14.81,37.76 14.81,33.95 | 14.81,33.95 14.81,30.9 15.57,30.14 16.39,30.14 | 16.39,30.14 C13.1 | R10.1 16.14,33.95 14.81,33.95 | 16.39,30.14 16.39,27.39 U3.P10
SW_D1
  Top 0.305: R18.2 26.93,38.33 27.51,37.76 27.51,33.95 | 27.51,33.95 27.51,30.64 27,30.14 26.93,30.2 C14.1 | 25.92,30.14 C14.1 | R11.1 26.18,33.95 27.51,33.95 | U3.P11 18.36,26.07 21.66,29.37 25.03,29.37 25.86,30.2 C14.1
USB_5V  (via drill 0.5)
  Top 0.305: CHG.A 58.02,28.58 57.73,28.87 55.7,28.87 48.59,35.98 48.59,40.04 v47.95,40.68
  Top 0.406: CON_USB.VUSB 36.6,32.37 34.87,30.64 v33.6,30.64 | SW_PWR.P1 v61.29,37.25
  Bottom 0.406: U5.4 67.16,33.09 C15.2 67.06,34.27 66.37,34.96 64.59,34.96 61.29,38.26 | v33.6,30.64 39.7,36.74 39.7,39.79 41.98,42.07 46.56,42.07 v47.95,40.68 49.1,39.53 60.02,39.53 61.29,38.26 | 61.29,38.26 v61.29,37.25

### Text on the board
Bottom: 0 | 1 | 0 | 1 | 0 | 1 | A0 | A1 | A2
tNames: BL | OFF | BAT | USB | USB | B0 | B1 | UART | GND | uC RX | !RST | SWD / IO | SWD / CLK | GND | 3V3 | uC TX | 1 | 2 | 3 | 4 | SDA | SCL | MISO | MOSI | SCK | 3V3 | GND | A0 | A1 | A2 | A3 | A4 | A5 | P0 | P1 | P2 | P3 | P4 | ARM bmw | v2 | vsergeev / CC-BY-4.0